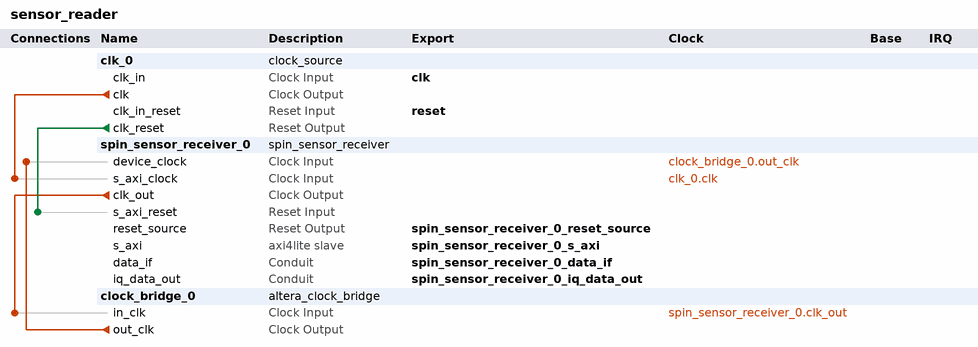
[diagram p0: system contents]
# Platform Designer (Qsys) system sensor_reader, Cyclone V 5CEBA4F23C8
# Parameters at their usual value, and those the tool derives, are not listed.
package require -exact qsys 20.1
create_system sensor_reader
set_project_property DEVICE_FAMILY {Cyclone V}
set_project_property DEVICE 5CEBA4F23C8

add_instance clk_0 clock_source 20.1
set_instance_parameter_value clk_0 clockFrequency 50000000

add_instance spin_sensor_receiver_0 spin_sensor_receiver 1.0
set_instance_parameter_value spin_sensor_receiver_0 FPGA_TECHNOLOGY CYCLONE5

add_instance clock_bridge_0 altera_clock_bridge 20.1
set_instance_parameter_value clock_bridge_0 DERIVED_CLOCK_RATE 0
set_instance_parameter_value clock_bridge_0 EXPLICIT_CLOCK_RATE 0

# connections
add_connection clk_0.clk spin_sensor_receiver_0.s_axi_clock clock
add_connection clock_bridge_0.out_clk spin_sensor_receiver_0.device_clock clock
add_connection spin_sensor_receiver_0.clk_out clock_bridge_0.in_clk clock
add_connection clk_0.clk_reset spin_sensor_receiver_0.s_axi_reset reset

# exported interfaces
add_interface clk clock sink
set_interface_property clk EXPORT_OF clk_0.clk_in
add_interface reset reset sink
set_interface_property reset EXPORT_OF clk_0.clk_in_reset
add_interface spin_sensor_receiver_0_data_if conduit end
set_interface_property spin_sensor_receiver_0_data_if EXPORT_OF spin_sensor_receiver_0.data_if
add_interface spin_sensor_receiver_0_iq_data_out conduit end
set_interface_property spin_sensor_receiver_0_iq_data_out EXPORT_OF spin_sensor_receiver_0.iq_data_out
add_interface spin_sensor_receiver_0_reset_source reset source
set_interface_property spin_sensor_receiver_0_reset_source EXPORT_OF spin_sensor_receiver_0.reset_source
add_interface spin_sensor_receiver_0_s_axi axi4lite slave
set_interface_property spin_sensor_receiver_0_s_axi EXPORT_OF spin_sensor_receiver_0.s_axi

set_interconnect_requirement {$system} qsys_mm.clockCrossingAdapter HANDSHAKE
set_interconnect_requirement {$system} qsys_mm.enableEccProtection FALSE
set_interconnect_requirement {$system} qsys_mm.insertDefaultSlave FALSE
set_interconnect_requirement {$system} qsys_mm.maxAdditionalLatency 1

save_system sensor_reader.qsys
